# Altium project Engineering_project_DC_LOAD.PrjPcb
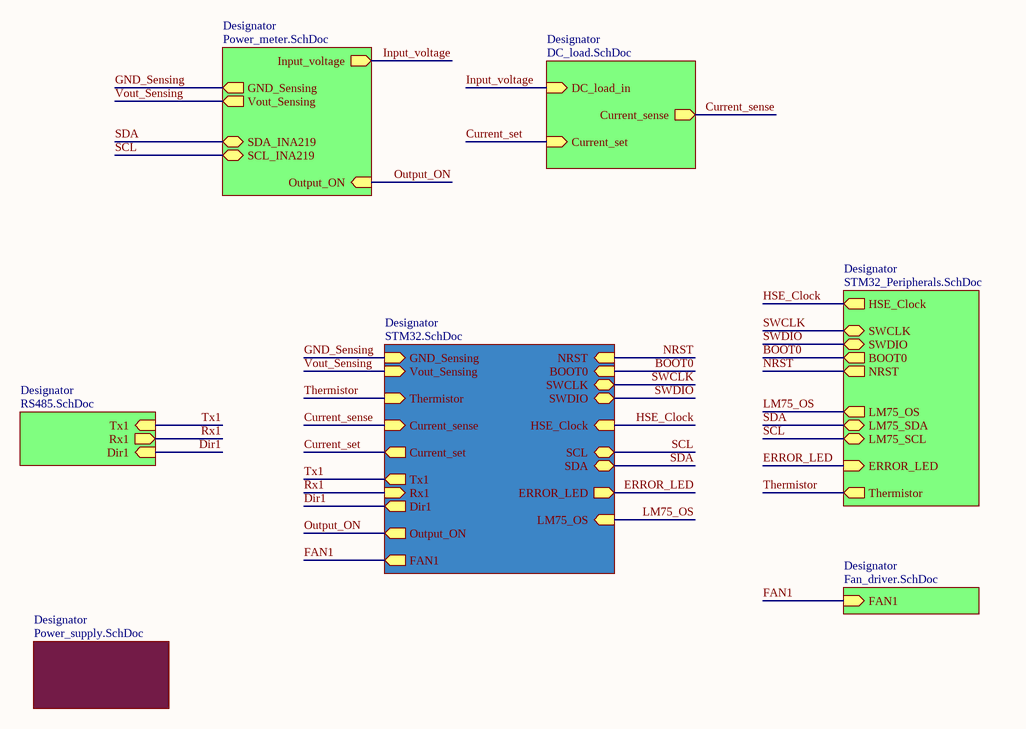
[diagram p0: Main.SchDoc]
8 sheets, 109 parts. Net scope: hierarchical (ports join the sheet entries above them; power ports are global).
Board file: PCB1.PcbDoc
Sheets:
  Main.SchDoc
    Designator = DC_load.SchDoc
    Designator = Power_meter.SchDoc
    Designator = RS485.SchDoc
    Designator = Fan_driver.SchDoc
    Designator = Power_supply.SchDoc
    Designator = STM32.SchDoc
    Designator = STM32_Peripherals.SchDoc

## Sheet Main.SchDoc
size A; SheetNumber: 1; SheetTotal: 8

### Sub-sheets
Designator = DC_load.SchDoc: Current_set (in), DC_load_in (in), Current_sense (out)
Designator = Power_meter.SchDoc: SCL_INA219 (bidir), SDA_INA219 (bidir), Output_ON (in), GND_Sensing (out), Vout_Sensing (out), Input_voltage (out)
Designator = RS485.SchDoc: Tx1 (in), Rx1 (out), Dir1 (in)
Designator = Fan_driver.SchDoc: FAN1 (in)
Designator = Power_supply.SchDoc: no entries
Designator = STM32.SchDoc: NRST (in), BOOT0 (in), SWCLK (bidir), SWDIO (bidir), SCL (bidir), SDA (bidir), GND_Sensing (in), Vout_Sensing (in), FAN1 (out), LM75_OS (in), HSE_Clock (in), ERROR_LED (out), Tx1 (out), Rx1 (in), Dir1 (out), Output_ON (out), Current_set (out), Thermistor (in), Current_sense (in)
Designator = STM32_Peripherals.SchDoc: HSE_Clock (out), SWCLK (bidir), SWDIO (bidir), BOOT0 (out), NRST (out), LM75_OS (out), LM75_SDA (bidir), LM75_SCL (bidir), ERROR_LED (in), Thermistor (out)

### Nets
BOOT0: sheet Designator/BOOT0, sheet Designator/BOOT0
Current_sense: sheet Designator/Current_sense, sheet Designator/Current_sense
Current_set: sheet Designator/Current_set, sheet Designator/Current_set
Dir1: sheet Designator/Dir1, sheet Designator/Dir1
ERROR_LED: sheet Designator/ERROR_LED, sheet Designator/ERROR_LED
FAN1: sheet Designator/FAN1, sheet Designator/FAN1
GND_Sensing: sheet Designator/GND_Sensing, sheet Designator/GND_Sensing
HSE_Clock: sheet Designator/HSE_Clock, sheet Designator/HSE_Clock
Input_voltage: sheet Designator/DC_load_in, sheet Designator/Input_voltage
LM75_OS: sheet Designator/LM75_OS, sheet Designator/LM75_OS
NRST: sheet Designator/NRST, sheet Designator/NRST
Output_ON: sheet Designator/Output_ON, sheet Designator/Output_ON
Rx1: sheet Designator/Rx1, sheet Designator/Rx1
SCL: sheet Designator/SCL_INA219, sheet Designator/SCL, sheet Designator/LM75_SCL
SDA: sheet Designator/SDA_INA219, sheet Designator/SDA, sheet Designator/LM75_SDA
SWCLK: sheet Designator/SWCLK, sheet Designator/SWCLK
SWDIO: sheet Designator/SWDIO, sheet Designator/SWDIO
Thermistor: sheet Designator/Thermistor, sheet Designator/Thermistor
Tx1: sheet Designator/Tx1, sheet Designator/Tx1
Vout_Sensing: sheet Designator/Vout_Sensing, sheet Designator/Vout_Sensing

## Sheet DC_load.SchDoc
size A; SheetNumber: 8; SheetTotal: 8
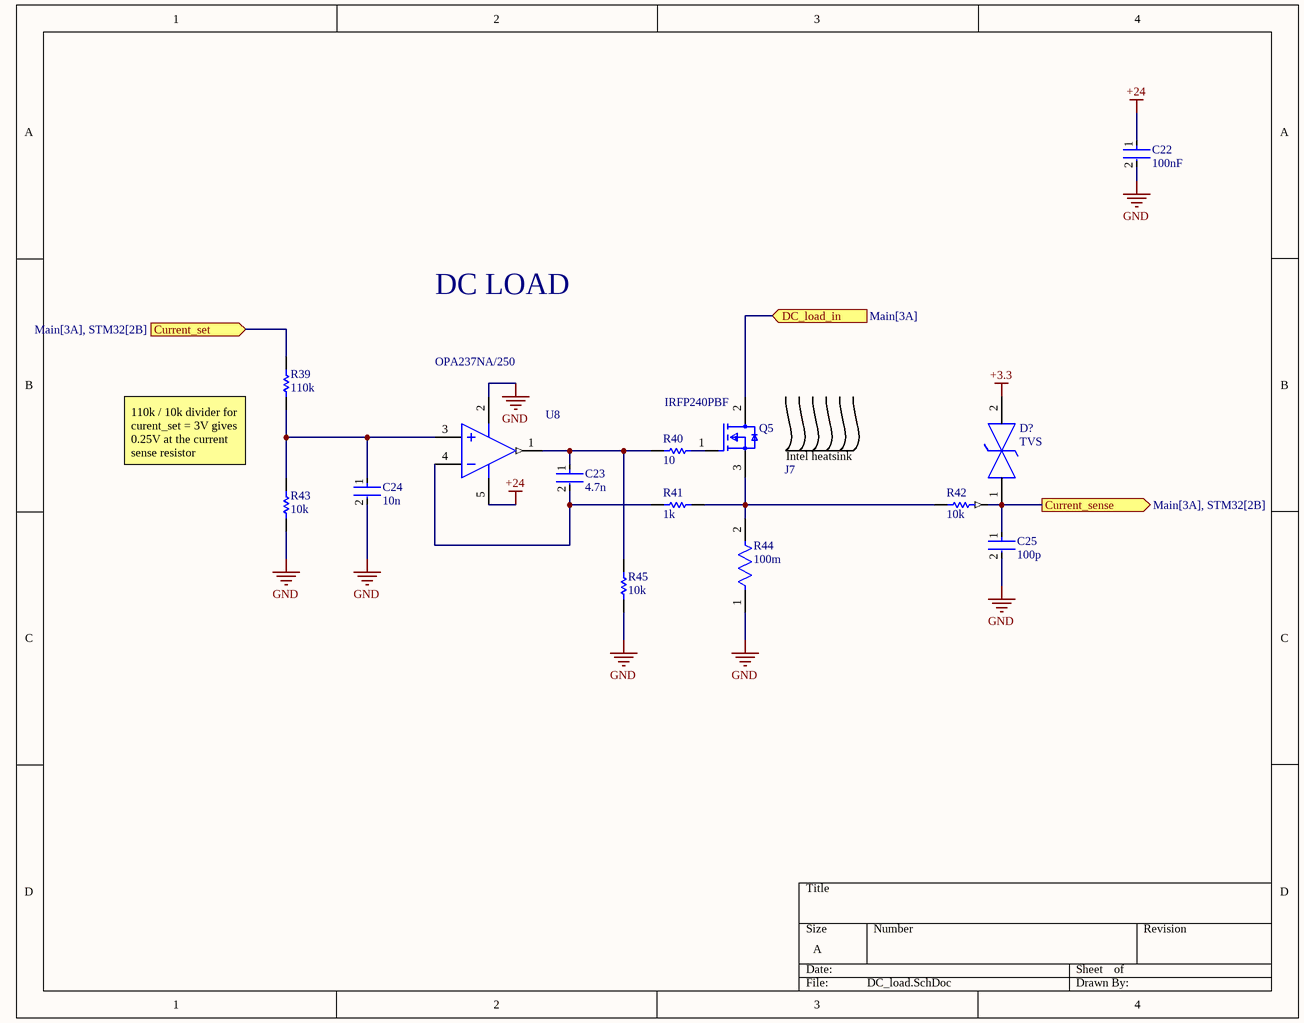
[diagram p1: DC_load.SchDoc]

### Parts
C22  100nF  [FP-0805-L_2_01_0_2-W_1_25-IPC_B]
C23  4.7n  [FP-0805-L_2_01_0_2-W_1_25-IPC_B]
C24  10n  [FP-0805-L_2_01_0_2-W_1_25-IPC_B]
C25  100p  [FP-0805-L_2_01_0_2-W_1_25-IPC_B]
D?  TVS  [FP-SMB-MFG]
J7  Intel heatsink  [Intel heatsink mount]  (value not drawn)
Q5  IRFP240PBF  [FP-E19-0614-MFG]
R39  110k  [RESC2013X50X30LL20T20]
R40  10  [RESC2013X50X30LL20T20]
R41  1k  [RESC2013X50X30LL20T20]
R42  10k  [RESC2013X50X30LL20T20]
R43  10k  [RESC2013X50X30LL20T20]
R44  100m  [FP-CRM2512-MFG]
R45  10k  [RESC2013X50X30LL20T20]
U8  OPA237NA/250  [DBV0005A_N]

### Ports
Current_sense (out, see Main[3A], STM32[2B]), Current_set (in, see Main[3A], STM32[2B]), DC_load_in (in, see Main[3A])

### Nets
+3.3: D?.2
+24: C22.1 U8.5(V+)
GND: C22.2 C24.2 C25.2 R43.1 R44.1 R45.1 U8.2(V-)
Current_sense: C25.1 D?.1 R42.1 ; port Current_sense
Current_set: R39.2 ; port Current_set
Input_voltage: Q5.2(D) ; port DC_load_in
NetC23_1: C23.1 R40.2 R45.2 U8.1(OUT)
NetC23_2: C23.2 R41.2 U8.4(IN-)
NetC24_1: C24.1 R39.1 R43.2 U8.3(IN+)
NetQ5_1: Q5.1(G) R40.1
NetQ5_3: Q5.3(S) R41.1 R42.2 R44.2

### Notes on the sheet
- DC LOAD
- 110k / 10k divider for curent_set = 3V gives 0.25V at the current sense resistor

### Library data of the parts
C22-C25 = CMP-2007-04174-2: General Purpose Ceramic Capacitor, 0805, 100nF, 10%, X7R, 15%, 100V; Packaging: Tape and Reel; Min Operating Temperature: -55°C; Dielectric Material: Ceramic; Height: 1.4mm; Voltage Rating: 100V; Termination: SMD/SMT; Case Code (Imperial): 0805; Case Code (Metric): 2012; Case/Package: 0805; Construction: Flat; Radiation Hardening: No; Series: -; Dielectric: X7R; Package Quantity: 2000; Mount: Surface Mount; Capacitance: 100nF; Contact Plating: Tin; Voltage: 100V; Lead Free: Lead Free; Depth: 1.25mm; RoHS Compliant: Yes; Number of Pins: 2; Max Operating Temperature: 125°C; Length: 2.01mm; Voltage Rating (DC): 100V; Thickness: 0.055inch; REACH SVHC: No SVHC; Width: 0.049inch; Tolerance: 10%
D? = CMP-12225-000039-1: TVS DIODE 28.2V 59V SMB; Manufacturer Part Number: SM6T33CA; Manufacturer: STMicroelectronics; Max Junction Temp: +150°C; Standoff Height: 0.05mm; Direction: Bidirectional; Number Of Channels: 1; Reverse Standoff Voltage: 33V; Peak Pulse Current: 68A; Breakdown Voltage: 31.4V; Peak Pulse Power: 600W; Mouser Description: TVS Diodes - Transient Voltage Suppressors 600W 33V Bidirect; Device Class L1: Circuit Protection; Device Class L3: unset; Temperature Range Low: -55°C; Octopart: https://octopart.com/sm6t33ca-stmicroelectronics-55399331; Height: 2.65mm; Digikey Description: TVS DIODE 28.2V 59V SMB; Automotive: No; Category: Diode; Device Class L2: TVS Diodes; Temperature: -55°C to +150°C; ComponentLink2URL: https://www.st.com/resource/en/datasheet/sm6t.pdf; Lead Free: Yes; Clamping Voltage: 59V; RoHS: TRUE; Temperature Range High: +150°C; Package: SMB; ComponentLink2Description: Datasheet
Q5 = CMP-02550-000013-1: MOSFET N-CH 200V 20A TO-247AC; Manufacturer: Vishay; Threshold Vgs: 4V; Input Capacitace At Vds: 1300pF @ 25V; Threshold Vgs Min: 2V; Reverse Recovery Time: 300ns; Pulse Drain Current: 80A; Depletion Mode: False; Power Dissipation: 150W; Number Of Channels: 1; Turn Off Delay Time: 45ns; Gate Charge At Vgs: 70nC @ 10V; Turn On Delay Time: 14ns; Reverse Recovery Charge: 3400nC; Rthja Max: 40°C/W; Gate To Source Voltage: 20V; Drain To Source Resistance: 0.18Ω; Max Junction Temp: +150°C; Standoff Height: 3.71mm; Category: Trans; Device Class L1: Discrete Semiconductors; Continuous Drain Current: 20A; Manufacturer Part Number: IRFP240PBF; Technology: MOSFET; Temperature Range Low: -55°C; Device Class L3: MOSFETs; Octopart: https://octopart.com/irfp240pbf-vishay-46527395; RoHS: TRUE; Threshold Vgs Max: 4V; Max Forward Diode Voltage: 2V; Lead Free: Yes; Mouser Description: MOSFET N-Chan 200V 20 Amp; Temperature Range High: +150°C; ComponentLink2Description: Datasheet; Number Of N Channels: 1; Height: 25.11mm; Ipc Land Pattern Name: TO-220; Temperature: -55°C to +150°C; Device Class L2: Transistors; ComponentLink2URL: http://www.vishay.com/docs/91210/91210.pdf; Package: E19-0614; Drain To Source Voltage: 200V; Digikey Description: MOSFET N-CH 200V 20A TO-247AC; Automotive: No; Drain To Source Breakdown Voltage: 200V
R39-R43 R45 = CMP-2001-04896-1: Manufacturer: Vishay Dale; Part Number: CRCW08050000Z0EA
R44 = CMP-07231-000004-1: RES 0.1 OHM 1% 2W 2512; Manufacturer: Bourns; 3DS Part Number: 110-00004; Manufacturer Part Number: CRM2512-FX-R100ELF; Resistance: 100mΩ; Voltage: 1.349V; Temperature Coefficient: 100ppm/°C; Value: 100mΩ; Voltage Rating: 1349mV; ComponentLink2Description: Datasheet; Lead Free: Yes; RoHS: TRUE; Ipc Land Pattern Name: RESC630310X60; Temperature: -55°C to +155°C; Package: CRM2512; Temperature Range High: +155°C; Mouser Description: Thick Film Resistors 2watts 1% .1ohms 100 PPM 2512; Category: Res; Temperature Range Low: -55°C; Series: CRM2512; Device Class L3: Chip SMD Resistors; Composition: Thick Film; Height: 0.8mm; Device Class L2: Resistors; Automotive: No; Device Class L1: Passive Components; Octopart: https://octopart.com/crm2512-fx-r100elf-bourns-9081968; Digikey Description: RES 0.1 OHM 1% 2W 2512; Power Rating: 2W; ComponentLink2URL: https://www.bourns.com/docs/product-datasheets/crm.pdf?sfvrsn=580c66f6_5; Tolerance: 1%
U8 = CMP-0272-00854-3: Single-Supply Operational Amplifier MicroAmplifier(TM) Series, 2.7 to 36 V, -55 to 125 degC, 5-pin SOT23 (DBV5), Green (RoHS & no Sb/Br); Manufacturer: Texas Instruments; Total Supply Voltage(Max)(+5V is 5, +/-5V is 10): 36; Packing: SMALL T&R; CMRR(Min)(dB): 78; Vio (25C)(Max)(mV): 0.75; Total Supply Voltage(Min)(+5V is 5, +/-5V is 10): 2.7; Rating: Catalog; Slew Rate(Typ)(V/us): 0.5; Number of Channels: 1; GBW(Typ)(MHz): 1.4; Sub Family: High Supply Voltage Amplifier (>=30V), Low Power Amp (<=500uA), Low Supply Voltage Amplifier (<=2.7V), Precision Amplifier; IIB(Max)(pA): 40000; Iq per channel(Max)(mA): 0.35; Offset Drift(Typ)(uV/C): 2; DatasheetVersion: SBOS057A; PackageVersion: 4073253-4/K, 03/2006; ComponentLink1URL: http://www.ti.com/; ComponentLink2Description: Datasheet; ComponentLink3Description: Package Specification; PackageReference: DBV0005A; Mounting Technology: Surface Mount; ComponentLink3URL: http://www.ti.com/litv/pdf/mpds018i; PartNumber: OPA237NA/250; Eco-Plan: Green (RoHS & no Sb/Br); ComponentLink1Description: Manufacturer URL; PackageDescription: 5-Pin Plastic Small Outline, Body 1.6 x 2.9 mm, Pitch 0.95 mm; ComponentLink2URL: http://www.ti.com/lit/ds/symlink/opa237.pdf; Code_JEDEC: MO-178

## Sheet Power_meter.SchDoc
size A; SheetNumber: 7; SheetTotal: 8
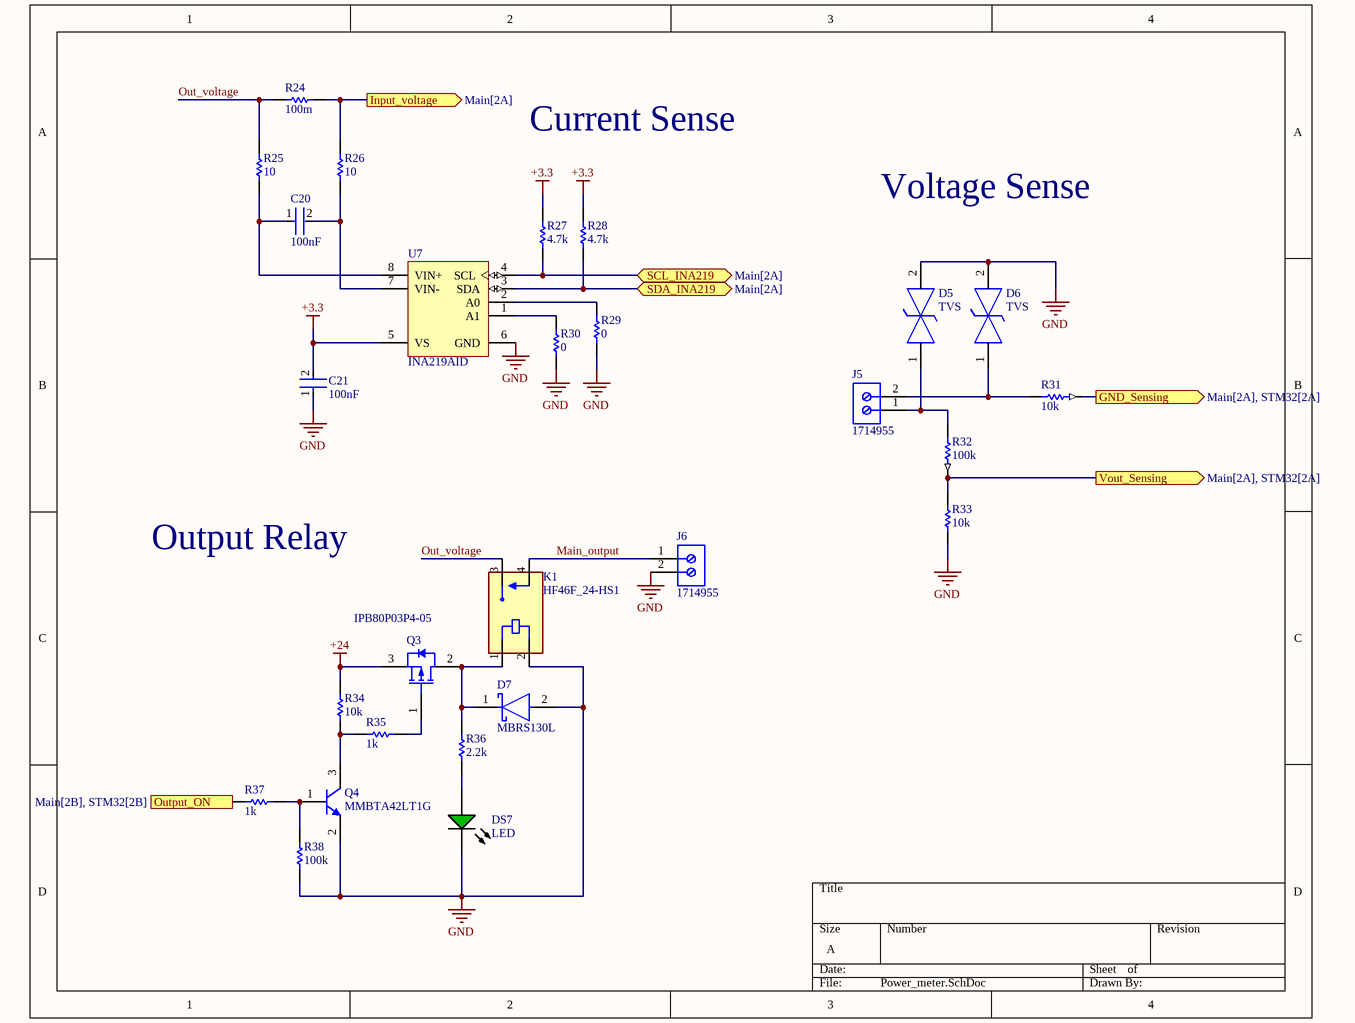
[diagram p2: Power_meter.SchDoc]

### Parts
C20  100nF  [FP-0805-L_2_01_0_2-W_1_25-IPC_B]
C21  100nF  [FP-0805-L_2_01_0_2-W_1_25-IPC_B]
D5  TVS  [FP-SMB-MFG]
D6  TVS  [FP-SMB-MFG]
D7  MBRS130L  [FP-403AF-MFG]
DS7  LED  [AVAG-HSMX-C170_V]
J5  1714955  [PHOE-1714955_V]
J6  1714955  [PHOE-1714955_V]
K1  HF46F_24-HS1  [RELAY_HF46F_005-HS1]
Q3  IPB80P03P4-05  [INF-PG-TO263-3-2_N]
Q4  MMBTA42LT1G  [ONSC-SOT-23-3-318-08_V]
R24  100m  [RESC3216X70X50NL05T20]
R25  10  [RESC2013X50X30LL20T20]
R26  10  [RESC2013X50X30LL20T20]
R27  4.7k  [RESC2013X50X30LL20T20]
R28  4.7k  [RESC2013X50X30LL20T20]
R29  0  [RESC2013X50X30LL20T20]
R30  0  [RESC2013X50X30LL20T20]
R31  10k  [RESC2013X50X30LL20T20]
R32  100k  [RESC2013X50X30LL20T20]
R33  10k  [RESC2013X50X30LL20T20]
R34  10k  [RESC2013X50X30LL20T20]
R35  1k  [RESC2013X50X30LL20T20]
R36  2.2k  [RESC2013X50X30LL20T20]
R37  1k  [RESC2013X50X30LL20T20]
R38  100k  [RESC2013X50X30LL20T20]
U7  INA219AID  [D0008A_N]

### Ports
GND_Sensing (out, see Main[2A], STM32[2A]), Input_voltage (out, see Main[2A]), Output_ON (in, see Main[2B], STM32[2B]), SCL_INA219 (bidir, see Main[2A]), SDA_INA219 (bidir, see Main[2A]), Vout_Sensing (out, see Main[2A], STM32[2A])

### Nets
+3.3: C21.2 R27.2 R28.2 U7.5(VS)
+24: Q3.3(SOURCE) R34.2
GND: C21.1 D5.2 D6.2 D7.2(A) DS7.2(K) J6.2 K1.2(COIL2) Q4.2(E) R29.1 R30.1 R33.2 R38.1 U7.6(GND)
GND_Sensing: R31.1 ; port GND_Sensing
Input_voltage: R24.2 R26.2 ; port Input_voltage
Main_output: J6.1 K1.4(NO)
Out_voltage: K1.3(COM) R24.1 R25.2
Output_ON: R37.1 ; port Output_ON
SCL: R27.1 U7.4(SCL) ; port SCL_INA219
SDA: R28.1 U7.3(SDA) ; port SDA_INA219
Vout_Sensing: R32.2 R33.1 ; port Vout_Sensing
NetC20_1: C20.1 R25.1 U7.8(VIN+)
NetC20_2: C20.2 R26.1 U7.7(VIN-)
NetD5_1: D5.1 J5.1 R32.1
NetD6_1: D6.1 J5.2 R31.2
NetD7_1: D7.1(C) K1.1(COIL1) Q3.2(DRAIN) R36.2
NetDS7_1: DS7.1(A) R36.1
NetQ3_1: Q3.1(GATE) R35.2
NetQ4_1: Q4.1(B) R37.2 R38.2
NetQ4_3: Q4.3(C) R34.1 R35.1
NetR29_2: R29.2 U7.2(A0)
NetR30_2: R30.2 U7.1(A1)

### Notes on the sheet
- Current Sense
- Voltage Sense
- Output Relay

### Library data of the parts
C20 C21 = CMP-2007-04174-2: as C22 on sheet DC_load; Packaging: Tape and Reel; Min Operating Temperature: -55°C; Dielectric Material: Ceramic; Height: 1.4mm; Voltage Rating: 100V; Termination: SMD/SMT; Case Code (Imperial): 0805; Case Code (Metric): 2012; Case/Package: 0805; Construction: Flat; Radiation Hardening: No; Series: -; Dielectric: X7R; Package Quantity: 2000; Mount: Surface Mount; Capacitance: 100nF; Contact Plating: Tin; Voltage: 100V; Lead Free: Lead Free; Depth: 1.25mm; RoHS Compliant: Yes; Number of Pins: 2; Max Operating Temperature: 125°C; Length: 2.01mm; Voltage Rating (DC): 100V; Thickness: 0.055inch; REACH SVHC: No SVHC; Width: 0.049inch; Tolerance: 10%
D5 D6 = CMP-12225-000039-1: as D? on sheet DC_load; Mouser Description: TVS Diodes - Transient Voltage Suppressors 600W 33V Bidirect; Device Class L1: Circuit Protection; Device Class L3: unset; Temperature Range Low: -55°C; Octopart: https://octopart.com/sm6t33ca-stmicroelectronics-55399331; Height: 2.65mm; Digikey Description: TVS DIODE 28.2V 59V SMB; Automotive: No; Category: Diode; Device Class L2: TVS Diodes; Temperature: -55°C to +150°C; ComponentLink2URL: https://www.st.com/resource/en/datasheet/sm6t.pdf; Lead Free: Yes; Clamping Voltage: 59V; RoHS: TRUE; Temperature Range High: +150°C; Package: SMB; ComponentLink2Description: Datasheet
D7 = CMP-00278-20916186-1: MBRS130L Rectifier Diode, Schottky, 1 Phase, 1 Element, 2A, 30V V(RRM), Silicon, DO-214AA; Manufacturer Lifecycle Status: OBSOLETE; Output Current: 1A; Forward Voltage: 445mV; Peak Reverse Current: 1mA; Max Surge Current: 40A; Polarity: Standard; Element Configuration: Single; Max Junction Temperature (Tj): 125°C; Lead Free: Lead Free; Packaging: Cut Tape; Mount: Surface Mount; Max Repetitive Reverse Voltage (Vrrm): 30V; Forward Current: 2A; Length: 4.75mm; Weight: 180mg; Radiation Hardening: No; Max Operating Temperature: 125°C; Schedule B: 8541100080; Peak Non-Repetitive Surge Current: 40A; Height: 2.45mm; Case/Package: SMB; Min Operating Temperature: -65°C; Average Rectified Current: 2A; Lifecycle Status: Obsolete; REACH SVHC: No SVHC; Voltage Rating (DC): 30V; Max Forward Surge Current (Ifsm): 40A; NexarPartId: 20916186; Max Reverse Leakage Current: 1mA; Number of Pins: 2; Width: 3.95mm; RoHS: Compliant; Max Reverse Voltage (DC): 30V; Current Rating: 1A
DS7 = CMP-2000-05062-1: Chip LED, Green, 2.2 V, -40 to 85 degC, 2-Pin SMD, Pb-Free, Tape and Reel; Manufacturer: Avago; No. of Pins: 2; Peak Wavelength: 570nm; SVHC: NoSVHC(16-Jun-2014); Dominant Wavelength: 572nm; Forward Current If: 20mA; Viewing Angle: 170deg; Lens Shape: Rectangular; PIV Max: 5V; External Width: 1.25mm; LED Type: Standard; External Depth: 0.8mm; Opto Mounting Orientation: Top; Luminous Intensity: 15mcd; Luminous Intensity Min: 4mcd; Forward Voltage VF Max: 2.6V; External Length / Height: 2mm; Bulb Size: 1.25mmx1.4mm; Light Area Height: 1mm; Voltage Vf Typ: 2.2V; Operating Temperature Max: 85degC; Datasheet Version: Oct-08; MSL: MSL2A-4weeks; Peak Forward Current: 20mA; Package Description: 2-Pin Surface Mount Device, Body 2 x 1.25 mm, Height 0.8 mm; Datasheet URL: https://datasheet.ciiva.com/29280/180495-da-01-en-chip-led-hsmg-c170-gelb-gruen-29280971.pdf; Storage Temperature Min: -40degC; LED Colour: Green; Wavelength Typ: 570nm; Mounting Type: SMD; Forward Current If Max: 20mA; Dominant Wavelength Typ: 572nm; LED Mounting: SMD; Operating Temperature Range: -30degCto+85degC; Operating Temperature Min: -30degC; Manufacturer URL: http://www.avagotech.com/; Packaging: CutTape; Luminous Intensity Typ: 15mcd; Package Reference: HSMX-C170; Storage Temperature Max: 85degC; Opto Case Style: SMD; Forward Voltage: 2.2V
J5 J6 = CMP-2000-05797-1: PC Terminal Block, Pitch 6.35 mm, 1 x 2 Position, Height 21.5 mm, Tail Lenght 5.1 mm, RoHS, Bulk; Manufacturer: Phoenix Contact; Package Description: PC Terminal Block, Pitch 6.35 mm, 1 x 2 Position, Height 21.5 mm, Tail Lenght 5.1 mm; Datasheet URL: http://media.digikey.com/pdf/Data%20Sheets/Phoenix%20Contact%20PDFs/1714955.pdf; Package Reference: 1714955; Manufacturer URL: http://www.phoenixcontact.com/; Datasheet Version: 02/2010; Mounting Technology: ThroughHole
K1 = HF46F_005-HS1: Relay: electromagnetic; SPST-NO; Ucoil: 24VDC; 5A/250VAC; 5A/30VDC; MF: Hongfa; MP: HF46F/005-HS1; SnapEDA_Link: https://www.snapeda.com/parts/HF46F/005-HS1/Hongfa/view-part/?ref=snap; Package: None; Value: *; Check_prices: https://www.snapeda.com/parts/HF46F/005-HS1/Hongfa/view-part/?ref=eda
Q3 = CMP-1138-00228-1: OptiMOS-P2 Power-Transistor, -30 V VDS, -80 A ID, PG-TO263-3-2, Reel, Green; Manufacturer: Infineon; Green: TRUE; RthJC (max): 1.1 K/W; RDS (on) (max) (@10V): 4.7 mOhm; VGS(th) (max): -4 V; QG: 100 nC; ID (max): -80 A; IDpuls (max): -320 A; VDS (max): -30 V; Ptot (max): 137 W; VGS(th) (min): -2 V; DatasheetVersion: Rev. 1.0; PackageReference: PG-TO263-3-2; ComponentLink1Description: Manufacturer URL; Mounting Technology: Surface Mount; PackageDescription: 3-Pin Plastic (Green) Transistor Single Outline Package, 10 x 9.25 mm Body, 2.54 mm Pitch; ComponentLink2URL: http://www.infineon.com/dgdl/IPP_B_I80P03P4-05_DS_10.pdf?folderId=db3a304314dca3890114ef902baa05f9&fileId=db3a30431ddc9372011e07ef59f52807&location=en.Products.Automotive_ICs.Automotive_MOSFETs.Single__P-Channel_30V_MOSFETs.DATASHEET.IPP_B_I80P03P4-05_DS_1; ComponentLink3Description: Package Specification; ComponentLink2Description: Datasheet; ComponentLink3URL: http://www.infineon.com/dgdl/BTS141TC_DS_10.pdf?folderId=db3a3043163797a6011667aa084c0e01&fileId=db3a3043242ebc9e01242f43f58b003e&location=en.Products.Automotive_ICs.Smart_High-_and_Low-Side_Switches.HITFET___TEMPFET__-_Smart_Low-Side_Switches.DATASHEET.BT; Halogen-free: TRUE; Technology: OptiMOS-P2; Packing: Reel; PartNumber: IPB80P03P4-05; ComponentLink1URL: http://www.infineon.com/; PackageVersion: Jul-09
Q4 = CMP-1048-00662-1: High Voltage Transistor, NPN Silicon, 3-Pin SOT-23, Pb-Free, Tape and Reel; Manufacturer: On Semiconductor; fT Min (MHz): 50; IC Continuous (A): 0.5; ComponentLink1URL: http://www.onsemi.com/; ComponentLink3URL: http://www.onsemi.cn/pub_link/Collateral/318-08.PDF; RoHS: TRUE; ComponentLink2Description: Datasheet; PartNumber: MMBTA42LT1G; Polarity: NPN; DatasheetVersion: Rev. 12; PackageReference: SOT-23-3-318-08; PackageDescription: 3-Pin Small Outline Transistor, Body 2.92 x 1.3 mm, Pitch 0.95 mm; ComponentLink3Description: Package Specification; ComponentLink1Description: Manufacturer URL; Packing: Tape and Reel; PackageVersion: Rev. AP, 11/2009; Mounting Technology: Surface Mount; ComponentLink2URL: http://www.onsemi.cn/pub_link/Collateral/MMBTA42LT1-D.PDF
R24 = CMP-2003-00761-1: Shunt resistor; Part Number: ERJ8BSFR10V; Manufacturer: Panasonic
R25-R38 = CMP-2001-04896-1: as R39 on sheet DC_load
U7 = CMP-0704-00006-2: Zero-Drift, Bi-Directional Current / Power Monitor, 3 to 5.5 V, -40 to 125 degC, 8-pin SOIC (D8), Green (RoHS & no Sb/Br); Manufacturer: Texas Instruments; Vs(Max)(V): 5.5; Rating: Catalog; Gain(V/V): 1, 0.5, 0.25, 0.125; Vs(Min)(V): 3; Common Mode Range(Max)(V): 26; Input Offset (+/-)(Max)(uV): 100; Small-Signal Bandwidth(Typ)(MHz): 0.011; SubFamily: Current Shunt Monitor; Common Mode Range(Min)(V): 0; Quiescent Current (+/-)(Typ)(mA): 0.7; PartNumber: INA219AID; ComponentLink2Description: Datasheet; PackageVersion: 4040047-3/M, 06/2011; ComponentLink3Description: Package Specification; Mounting Technology: Surface Mount; ComponentLink2URL: http://www.ti.com/general/docs/lit/getliterature.tsp?genericPartNumber=INA219&fileType=pdf; Eco-Plan: Green (RoHS & no Sb/Br); DatasheetVersion: SBOS448F; Code_JEDEC: MS-012; PackageDescription: 8-Pin Plastic Small Outline, Body 4.9 x 3.9 mm, Pitch 1.27 mm; ComponentLink1Description: Manufacturer URL; ComponentLink1URL: http://www.ti.com/; PackageReference: D0008A; ComponentLink3URL: http://www.ti.com/lit/ml/msoi002j/msoi002j.pdf; CMRR(Min)(dB): 100

## Sheet RS485.SchDoc
size A; SheetNumber: 2; SheetTotal: 8
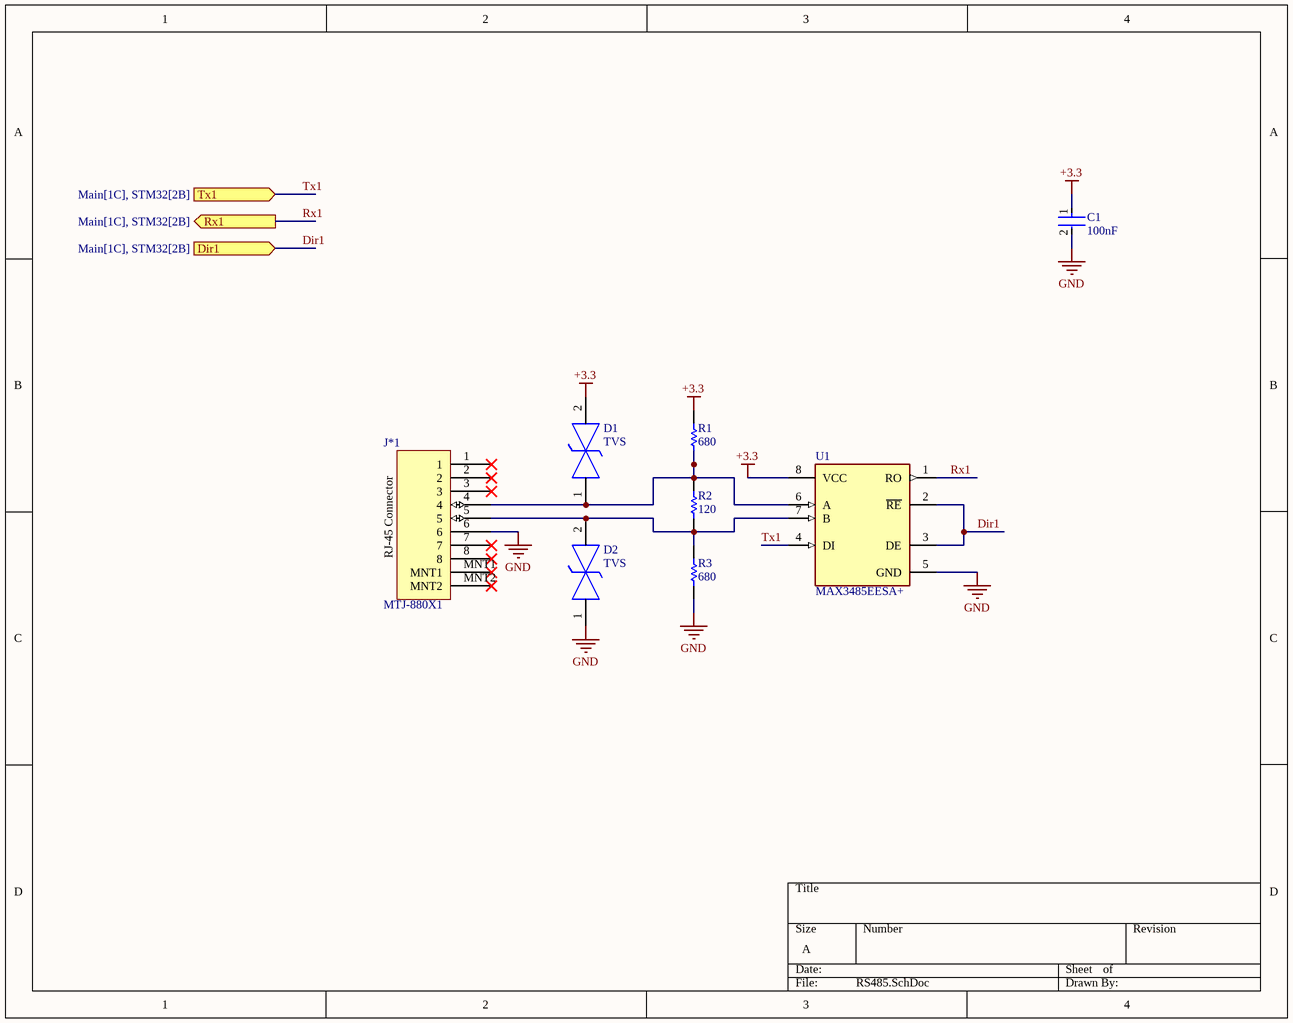
[diagram p3: RS485.SchDoc]

### Parts
C1  100nF  [FP-0805-L_2_01_0_2-W_1_25-IPC_B]
D1  TVS  [FP-SMB-MFG]
D2  TVS  [FP-SMB-MFG]
J*1  MTJ-880X1  [MTJ-880X1]
R1  680  [RESC2013X50X30LL20T20]
R2  120  [RESC2013X50X30LL20T20]
R3  680  [RESC2013X50X30LL20T20]
U1  MAX3485EESA+  [FP-S8-5-MFG]

### Ports
Dir1 (in, see Main[1C], STM32[2B]), Rx1 (out, see Main[1C], STM32[2B]), Tx1 (in, see Main[1C], STM32[2B])

### Nets
+3.3: C1.1 D1.2 R1.2 U1.8(VCC)
GND: C1.2 D2.1 J*1.6 R3.1 U1.5(GND)
Dir1: U1.2(~{RE}) U1.3(DE) ; port Dir1
Rx1: U1.1(RO) ; port Rx1
Tx1: U1.4(DI) ; port Tx1
NetD1_1: D1.1 J*1.4 R1.1 R2.2 U1.6(A)
NetD2_2: D2.2 J*1.5 R2.1 R3.2 U1.7(B)

Not connected (* = marked no-connect by the designer): J*1 1* 2* 3* 7* 8* MNT1* MNT2*

### Notes on the sheet
- (in symbol MTJ-880X1) RJ-45 Connector

### Library data of the parts
C1 = CMP-2007-04174-2: as C22 on sheet DC_load; Packaging: Tape and Reel; Min Operating Temperature: -55°C; Dielectric Material: Ceramic; Height: 1.4mm; Voltage Rating: 100V; Termination: SMD/SMT; Case Code (Imperial): 0805; Case Code (Metric): 2012; Case/Package: 0805; Construction: Flat; Radiation Hardening: No; Series: -; Dielectric: X7R; Package Quantity: 2000; Mount: Surface Mount; Capacitance: 100nF; Contact Plating: Tin; Voltage: 100V; Lead Free: Lead Free; Depth: 1.25mm; RoHS Compliant: Yes; Number of Pins: 2; Max Operating Temperature: 125°C; Length: 2.01mm; Voltage Rating (DC): 100V; Thickness: 0.055inch; REACH SVHC: No SVHC; Width: 0.049inch; Tolerance: 10%
D1 D2 = CMP-12225-000039-1: as D? on sheet DC_load; Mouser Description: TVS Diodes - Transient Voltage Suppressors 600W 33V Bidirect; Device Class L1: Circuit Protection; Device Class L3: unset; Temperature Range Low: -55°C; Octopart: https://octopart.com/sm6t33ca-stmicroelectronics-55399331; Height: 2.65mm; Digikey Description: TVS DIODE 28.2V 59V SMB; Automotive: No; Category: Diode; Device Class L2: TVS Diodes; Temperature: -55°C to +150°C; ComponentLink2URL: https://www.st.com/resource/en/datasheet/sm6t.pdf; Lead Free: Yes; Clamping Voltage: 59V; RoHS: TRUE; Temperature Range High: +150°C; Package: SMB; ComponentLink2Description: Datasheet
R1-R3 = CMP-2001-04896-1: as R39 on sheet DC_load
U1 = CMP-05679-000038-1: IC TXRX RS485/422 10MBPS 8SOIC; Manufacturer: Maxim Integrated; Number Of Receivers: 1; Simplex Duplex: Half Duplex; Data Rate: 15Mbits/s; Interface: RS-485,RS-422; Max Supply Voltage: 3.6V; Nominal Supply Current: 0.95-1.1mA; Min Supply Voltage: 3V; Standoff Height: 0.1mm; Mouser Description: RS-422/RS-485 Interface IC 3.3V 12Mbps Transceiver; Lead Free: Yes; Footprint Url: https://pdfserv.maximintegrated.com/land_patterns/90-0096.PDF; Device Class L1: Integrated Circuits (ICs); Device Class L3: RS-232 / RS-422 / RS-485 Interface ICs; RoHS: TRUE; Height: 1.75mm; ComponentLink2URL: https://datasheets.maximintegrated.com/en/ds/MAX3483E-MAX3491E.pdf; Temperature Range High: +85°C; Temperature: -40°C to +85°C; Manufacturer Part Number: MAX3485EESA+; Number Of Transmitters: 1; Device Class L2: Interface ICs; Octopart: https://octopart.com/max3485eesa%2B-maxim+integrated-39731903; ComponentLink2Description: Datasheet; Category: IC; Digikey Description: IC TXRX RS485/422 10MBPS 8SOIC; Automotive: No; Temperature Range Low: -40°C; Package: S8-5

## Sheet Fan_driver.SchDoc
size A; SheetNumber: 4; SheetTotal: 8
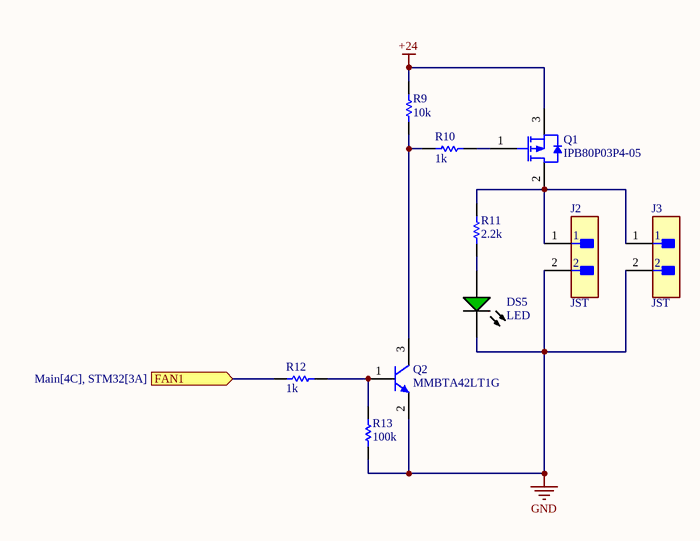
[diagram p4: Fan_driver.SchDoc]

### Parts
DS5  LED  [AVAG-HSMX-C170_V]
J2  JST  [FP-B2B-EH-A_LF_SN-MFG]
J3  JST  [FP-B2B-EH-A_LF_SN-MFG]
Q1  IPB80P03P4-05  [INF-PG-TO263-3-2_N]
Q2  MMBTA42LT1G  [ONSC-SOT-23-3-318-08_V]
R9  10k  [RESC2013X50X30LL20T20]
R10  1k  [RESC2013X50X30LL20T20]
R11  2.2k  [RESC2013X50X30LL20T20]
R12  1k  [RESC2013X50X30LL20T20]
R13  100k  [RESC2013X50X30LL20T20]

### Ports
FAN1 (in, see Main[4C], STM32[3A])

### Nets
+24: Q1.3(SOURCE) R9.2
GND: DS5.2(K) J2.2 J3.2 Q2.2(E) R13.1
FAN1: R12.1 ; port FAN1
NetDS5_1: DS5.1(A) R11.1
NetJ2_1: J2.1 J3.1 Q1.2(DRAIN) R11.2
NetQ1_1: Q1.1(GATE) R10.2
NetQ2_1: Q2.1(B) R12.2 R13.2
NetQ2_3: Q2.3(C) R9.1 R10.1

### Library data of the parts
DS5 = CMP-2000-05062-1: as DS7 on sheet Power_meter; Operating Temperature Max: 85degC; Datasheet Version: Oct-08; MSL: MSL2A-4weeks; Peak Forward Current: 20mA; Package Description: 2-Pin Surface Mount Device, Body 2 x 1.25 mm, Height 0.8 mm; Datasheet URL: https://datasheet.ciiva.com/29280/180495-da-01-en-chip-led-hsmg-c170-gelb-gruen-29280971.pdf; Storage Temperature Min: -40degC; LED Colour: Green; Wavelength Typ: 570nm; Mounting Type: SMD; Forward Current If Max: 20mA; Dominant Wavelength Typ: 572nm; LED Mounting: SMD; Operating Temperature Range: -30degCto+85degC; Operating Temperature Min: -30degC; Manufacturer URL: http://www.avagotech.com/; Packaging: CutTape; Luminous Intensity Typ: 15mcd; Package Reference: HSMX-C170; Storage Temperature Max: 85degC; Opto Case Style: SMD; Forward Voltage: 2.2V
J2 J3 = CMP-17439-000026-1: CONN HEADER VERT 2POS 2.5MM; Number of Contacts: 2; Current Rating: 3A; Connector Type: Plug; Contact Resistance: 20mR; Gender: Male; Voltage Rating: 250V; Fastening Type: Detent; Depth: 3.8mm; Max Operating Temperature: 85°C; Orientation: Straight; Series: EH; Contact Plating: Tin; Min Operating Temperature: -25°C; Contact Type: Male Pin; Housing Color: White; Termination: Press-Fit; Housing Material: Nylon; Pitch: 2.5mm; Number of Positions: 2; Max Current Rating: 3A; Packaging: Bulk; Lead Free: Lead Free; Number of Rows: 1; Length: 7.5mm; Contact Mating Length: 0.13inch; Color: Natural; Max Voltage Rating (AC): 250V; Contact Material: Copper Alloy; Mount: Through Hole
Q1 = CMP-1138-00228-1: as Q3 on sheet Power_meter; DatasheetVersion: Rev. 1.0; PackageReference: PG-TO263-3-2; ComponentLink1Description: Manufacturer URL; Mounting Technology: Surface Mount; PackageDescription: 3-Pin Plastic (Green) Transistor Single Outline Package, 10 x 9.25 mm Body, 2.54 mm Pitch; ComponentLink2URL: http://www.infineon.com/dgdl/IPP_B_I80P03P4-05_DS_10.pdf?folderId=db3a304314dca3890114ef902baa05f9&fileId=db3a30431ddc9372011e07ef59f52807&location=en.Products.Automotive_ICs.Automotive_MOSFETs.Single__P-Channel_30V_MOSFETs.DATASHEET.IPP_B_I80P03P4-05_DS_1; ComponentLink3Description: Package Specification; ComponentLink2Description: Datasheet; ComponentLink3URL: http://www.infineon.com/dgdl/BTS141TC_DS_10.pdf?folderId=db3a3043163797a6011667aa084c0e01&fileId=db3a3043242ebc9e01242f43f58b003e&location=en.Products.Automotive_ICs.Smart_High-_and_Low-Side_Switches.HITFET___TEMPFET__-_Smart_Low-Side_Switches.DATASHEET.BT; Halogen-free: TRUE; Technology: OptiMOS-P2; Packing: Reel; PartNumber: IPB80P03P4-05; ComponentLink1URL: http://www.infineon.com/; PackageVersion: Jul-09
Q2 = CMP-1048-00662-1: as Q4 on sheet Power_meter; ComponentLink1URL: http://www.onsemi.com/; ComponentLink3URL: http://www.onsemi.cn/pub_link/Collateral/318-08.PDF; RoHS: TRUE; ComponentLink2Description: Datasheet; PartNumber: MMBTA42LT1G; Polarity: NPN; DatasheetVersion: Rev. 12; PackageReference: SOT-23-3-318-08; PackageDescription: 3-Pin Small Outline Transistor, Body 2.92 x 1.3 mm, Pitch 0.95 mm; ComponentLink3Description: Package Specification; ComponentLink1Description: Manufacturer URL; Packing: Tape and Reel; PackageVersion: Rev. AP, 11/2009; Mounting Technology: Surface Mount; ComponentLink2URL: http://www.onsemi.cn/pub_link/Collateral/MMBTA42LT1-D.PDF
R9-R13 = CMP-2001-04896-1: as R39 on sheet DC_load

## Sheet Power_supply.SchDoc
size A; SheetNumber: 3; SheetTotal: 8
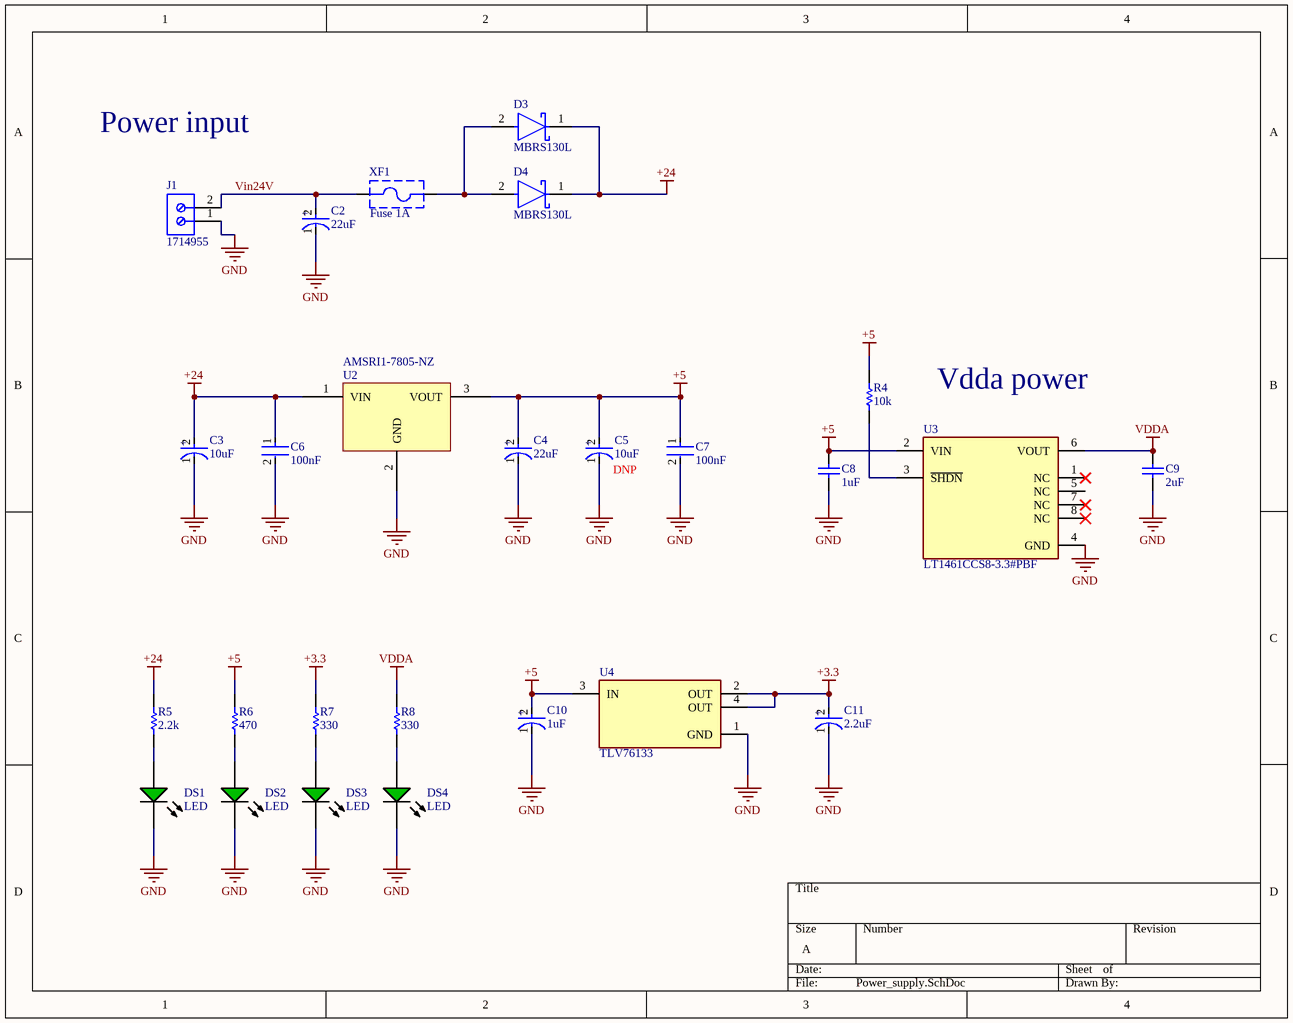
[diagram p5: Power_supply.SchDoc]

### Parts
C2  22uF  [FP-FCE-MFG]
C3  10uF  [FP-FKD-MFG]
C4  22uF  [FP-FCE-MFG]
C5  10uF  [FP-FKD-MFG]
C6  100nF  [FP-0805-L_2_01_0_2-W_1_25-IPC_B]
C7  100nF  [FP-0805-L_2_01_0_2-W_1_25-IPC_B]
C8  1uF  [CAPC2013X140X50LL20T25]
C9  2uF  [CAPC2013X140X50LL20T25]
C10  1uF  [FP-FKD-MFG]
C11  2.2uF  [FP-FKD-MFG]
D3  MBRS130L  [FP-403AF-MFG]
D4  MBRS130L  [FP-403AF-MFG]
DS1  LED  [AVAG-HSMX-C170_V]
DS2  LED  [AVAG-HSMX-C170_V]
DS3  LED  [AVAG-HSMX-C170_V]
DS4  LED  [AVAG-HSMX-C170_V]
J1  1714955  [PHOE-1714955_V]
R4  10k  [RESC2013X50X30LL20T20]
R5  2.2k  [RESC2013X50X30LL20T20]
R6  470  [RESC2013X50X30LL20T20]
R7  330  [RESC2013X50X30LL20T20]
R8  330  [RESC2013X50X30LL20T20]
U2  AMSRI1-7805-NZ  [SIP750W46P254L1400H1010Q3]
U3  LT1461CCS8-3.3#PBF  [FP-S8-8-05-08-1610-IPC_A]
U4  TLV76133  [FP-DCY0004A-MFG]
XF1  Fuse 1A  [696106003002]

### Nets
+3.3: C11.2(A) R7.2 U4.2(OUT) U4.4(OUT)
+5: C4.2(A) C5.2(A) C7.1 C8.2 C10.2(A) R4.2 R6.2 U2.3(VOUT) U3.2(VIN) U4.3(IN)
+24: C3.2(A) C6.1 D3.1(C) D4.1(C) R5.2 U2.1(VIN)
GND: C2.1(C) C3.1(C) C4.1(C) C5.1(C) C6.2 C7.2 C8.1 C9.1 C10.1(C) C11.1(C) DS1.2(K) DS2.2(K) DS3.2(K) DS4.2(K) J1.1 U2.2(GND) U3.4(GND) U4.1(GND)
VDDA: C9.2 R8.2 U3.6(VOUT)
Vin24V: C2.2(A) J1.2 XF1.1
NetD3_2: D3.2(A) D4.2(A) XF1.2
NetDS1_1: DS1.1(A) R5.1
NetDS2_1: DS2.1(A) R6.1
NetDS3_1: DS3.1(A) R7.1
NetDS4_1: DS4.1(A) R8.1
NetR4_1: R4.1 U3.3(~{SHDN})

Not connected (* = marked no-connect by the designer): U3 1(NC)* 5(NC) 7(NC)* 8(NC)*

### Notes on the sheet
- Power input
- Vdda power
- (near C5) DNP
- (in symbol CMP-2000-06207-2) +
- (in symbol CMP-05427-002128-1) +

### Library data of the parts
C2 C4 = CMP-05427-002128-1: CAP ALUM 22UF 20% 50V SMD; Ripple Current: 120mA; Material: Aluminium; ESR (Equivalent Series Resistance): 700mR; Polarity: Polar; Lead Length: 3.4mm; Leakage Current: 3uA; Life (Hours): 1000Hour; Diameter: 8mm; RoHS Compliant: Yes; Voltage Rating: 50V; Reach SVHC Compliant: Yes; Series: FC; Capacitance: 22uF; Ripple Current (AC): 120mA; Mount: Surface Mount; Min Operating Temperature: -40°C; Max Operating Temperature: 105°C; Radiation Hardening: No; Contact Plating: Tin; Impedance: 700mR; Construction: Cylindrical; Height - Seated (Max): 0.244inch; Packaging: Tape and Reel; Dielectric Material: Aluminium; Voltage: 50V; Voltage Rating (DC): 50V; Height: 6.2mm; Package Quantity: 1000; Length: 6.5mm; Lead Pitch: 2.2mm; Width: 8.3mm; Termination: SMD/SMT; Case/Package: Radial; Tolerance: 20%; Number of Pins: 2; Lead Free: Lead Free
C3 C5 C10 C11 = CMP-2000-06207-2: CAP ALUM 10UF 20% 50V SMD; Impedance: 880mR; Ripple Current: 165mA; Polarity: Polar; Leakage Current: 3uA; Lead Diameter: 0.65mm; Life (Hours): 2000Hour; REACH SVHC: No SVHC; Series: FK; Max Operating Temperature: 105°C; Radiation Hardening: No; Size: 5.8mm; Ripple Current (AC): 165mA; Lead Free: Lead Free; Voltage: 50V; Contact Plating: Tin; Case/Package: Radial; RoHS Compliant: Yes; Voltage Rating: 50V; Height - Seated (Max): 0.24inch; Package Quantity: 1000; Termination: SMD/SMT; Number of Pins: 2; Mount: Surface Mount; Packaging: Tape and Reel; Length: 5.8mm; Width: 7.8mm; Min Operating Temperature: -55°C; Height: 5.8mm; ESR (Equivalent Series Resistance): 880mR; Capacitance: 10uF; Diameter: 6.3mm; Voltage Rating (DC): 50V; Construction: Cylindrical; Tolerance: 20%; Lead Pitch: 1.8mm
C6 C7 = CMP-2007-04174-2: General Purpose Ceramic Capacitor, 0805, 10nF, 10%, X7R, 15%, 100V; Packaging: Tape and Reel; Min Operating Temperature: -55°C; Dielectric Material: Ceramic; Height: 1.4mm; Voltage Rating: 100V; Termination: SMD/SMT; Case Code (Imperial): 0805; Case Code (Metric): 2012; Case/Package: 0805; Construction: Flat; Radiation Hardening: No; Series: -; Dielectric: X7R; Package Quantity: 2000; Mount: Surface Mount; Capacitance: 100nF; Contact Plating: Tin; Voltage: 100V; Lead Free: Lead Free; Depth: 1.25mm; RoHS Compliant: Yes; Number of Pins: 2; Max Operating Temperature: 125°C; Length: 2.01mm; Voltage Rating (DC): 100V; Thickness: 0.055inch; REACH SVHC: No SVHC; Width: 0.049inch; Tolerance: 10%
C8 C9 = CMP-2007-03234-1: Part Number: C0805C105K3RACTU; Manufacturer: Kemet
D3 D4 = CMP-00278-20916186-1: as D7 on sheet Power_meter; Lead Free: Lead Free; Packaging: Cut Tape; Mount: Surface Mount; Max Repetitive Reverse Voltage (Vrrm): 30V; Forward Current: 2A; Length: 4.75mm; Weight: 180mg; Radiation Hardening: No; Max Operating Temperature: 125°C; Schedule B: 8541100080; Peak Non-Repetitive Surge Current: 40A; Height: 2.45mm; Case/Package: SMB; Min Operating Temperature: -65°C; Average Rectified Current: 2A; Lifecycle Status: Obsolete; REACH SVHC: No SVHC; Voltage Rating (DC): 30V; Max Forward Surge Current (Ifsm): 40A; NexarPartId: 20916186; Max Reverse Leakage Current: 1mA; Number of Pins: 2; Width: 3.95mm; RoHS: Compliant; Max Reverse Voltage (DC): 30V; Current Rating: 1A
DS1-DS4 = CMP-2000-05062-1: as DS7 on sheet Power_meter; Operating Temperature Max: 85degC; Datasheet Version: Oct-08; MSL: MSL2A-4weeks; Peak Forward Current: 20mA; Package Description: 2-Pin Surface Mount Device, Body 2 x 1.25 mm, Height 0.8 mm; Datasheet URL: https://datasheet.ciiva.com/29280/180495-da-01-en-chip-led-hsmg-c170-gelb-gruen-29280971.pdf; Storage Temperature Min: -40degC; LED Colour: Green; Wavelength Typ: 570nm; Mounting Type: SMD; Forward Current If Max: 20mA; Dominant Wavelength Typ: 572nm; LED Mounting: SMD; Operating Temperature Range: -30degCto+85degC; Operating Temperature Min: -30degC; Manufacturer URL: http://www.avagotech.com/; Packaging: CutTape; Luminous Intensity Typ: 15mcd; Package Reference: HSMX-C170; Storage Temperature Max: 85degC; Opto Case Style: SMD; Forward Voltage: 2.2V
J1 = CMP-2000-05797-1: as J5 on sheet Power_meter; Package Description: PC Terminal Block, Pitch 6.35 mm, 1 x 2 Position, Height 21.5 mm, Tail Lenght 5.1 mm; Datasheet URL: http://media.digikey.com/pdf/Data%20Sheets/Phoenix%20Contact%20PDFs/1714955.pdf; Package Reference: 1714955; Manufacturer URL: http://www.phoenixcontact.com/; Datasheet Version: 02/2010; Mounting Technology: ThroughHole
R4-R8 = CMP-2001-04896-1: as R39 on sheet DC_load
U2 = AMSRI1-7805-NZ: AMSRI1-7805-NZ, 5V / 1A DC output converter
U3 = CMP-09137-000077-1: IC VREF SERIES 0.08% 8SOIC; Output Type: Fixed; Max Output Current: 100mA; Reference Voltage: 3.3V; Quiescent Current: 50uA; Operating Supply Current: 70uA; Temperature Coefficient: 12ppm/°C; Max Input Voltage: 20V; Output Current: 100mA; Max Operating Temperature: 70°C; Width: 3.988mm; Series: -; REACH SVHC: No SVHC; RoHS Compliant: Yes; Length: 5mm; Case/Package: SOIC; Output Voltage: 3.3V; Mount: Surface Mount; Reference Type: Series; Package Quantity: 100; Min Output Voltage: 3.3V; Height: 1.498mm; Max Output Voltage: 3.3V; Min Operating Temperature: 0°C; Number of Pins: 8; Lead Free: Lead Free; Tolerance: 0.08%; Packaging: Rail/Tube
U4 = CMP-00370-134324849-1: TLV76133 1-A 16-V high-PSRR linear voltage regulator 4-SOT-223 -40 to 125; Manufacturer Lifecycle Status: ACTIVE; Number of Channels: 1; Min Supply Voltage: 6.5V; Nominal Supply Current: 65µA; Dropout Voltage: 900mV; Accuracy: 1%; Max Supply Voltage: 16V; Max Junction Temperature (Tj): 125°C; Output Current: 1A; Output Voltage: 5V; Width: 3.5mm; Length: 6.5mm; NexarPartId: 134324849; Max Operating Temperature: 125°C; Thickness: 1.6mm; Min Operating Temperature: -40°C; Case/Package: SOT-223; Height: 1.8mm; Lifecycle Status: Production; Number of Pins: 4; Number of Outputs: 1
XF1 = CMP-1502-00235-2: NexarPartId: 56808805; Fuse Current: 10A; Voltage Rating (AC): 250V; RoHS: Non-Compliant; Min Operating Temperature: -30°C; Height: 11.6mm; Packaging: Box; Mount: Through Hole; REACH SVHC: Unknown; Max Operating Temperature: 120°C

## Sheet STM32.SchDoc
size A; SheetNumber: 6; SheetTotal: 8
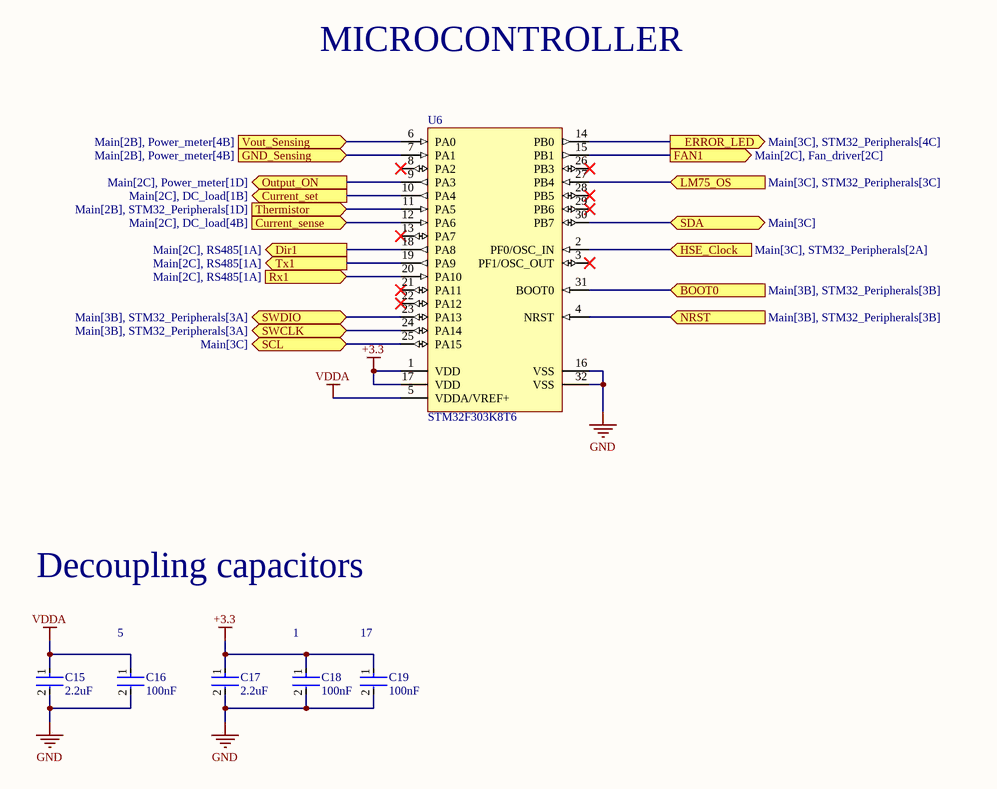
[diagram p6: STM32.SchDoc]

### Parts
C15  2.2uF  [FP-0805-L_2_01_0_2-W_1_25-IPC_B]
C16  100nF  [FP-CGA3E-0_3-0_1-IPC_A]
C17  2.2uF  [FP-0805-L_2_01_0_2-W_1_25-IPC_B]
C18  100nF  [FP-CGA3E-0_3-0_1-IPC_A]
C19  100nF  [FP-CGA3E-0_3-0_1-IPC_A]
U6  STM32F303K8T6  [STM-LQFP32_M]

### Ports
BOOT0 (in, see Main[3B], STM32_Peripherals[3B]), Current_sense (in, see Main[2C], DC_load[4B]), Current_set (out, see Main[2C], DC_load[1B]), Dir1 (out, see Main[2C], RS485[1A]), ERROR_LED (out, see Main[3C], STM32_Peripherals[4C]), FAN1 (out, see Main[2C], Fan_driver[2C]), GND_Sensing (in, see Main[2B], Power_meter[4B]), HSE_Clock (in, see Main[3C], STM32_Peripherals[2A]), LM75_OS (in, see Main[3C], STM32_Peripherals[3C]), NRST (in, see Main[3B], STM32_Peripherals[3B]), Output_ON (out, see Main[2C], Power_meter[1D]), Rx1 (in, see Main[2C], RS485[1A]), SCL (bidir, see Main[3C]), SDA (bidir, see Main[3C]), SWCLK (bidir, see Main[3B], STM32_Peripherals[3A]), SWDIO (bidir, see Main[3B], STM32_Peripherals[3A]), Thermistor (in, see Main[2B], STM32_Peripherals[1D]), Tx1 (out, see Main[2C], RS485[1A]), Vout_Sensing (in, see Main[2B], Power_meter[4B])

### Nets
+3.3: C17.1 C18.1 C19.1 U6.1(VDD) U6.17(VDD)
GND: C15.2 C16.2 C17.2 C18.2 C19.2 U6.16(VSS) U6.32(VSS)
VDDA: C15.1 C16.1 U6.5(VDDA/VREF+)
BOOT0: U6.31(BOOT0) ; port BOOT0
Current_sense: U6.12(PA6) ; port Current_sense
Current_set: U6.10(PA4) ; port Current_set
Dir1: U6.18(PA8) ; port Dir1
ERROR_LED: U6.14(PB0) ; port ERROR_LED
FAN1: U6.15(PB1) ; port FAN1
GND_Sensing: U6.7(PA1) ; port GND_Sensing
HSE_Clock: U6.2(PF0/OSC_IN) ; port HSE_Clock
LM75_OS: U6.27(PB4) ; port LM75_OS
NRST: U6.4(NRST) ; port NRST
Output_ON: U6.9(PA3) ; port Output_ON
Rx1: U6.20(PA10) ; port Rx1
SCL: U6.25(PA15) ; port SCL
SDA: U6.30(PB7) ; port SDA
SWCLK: U6.24(PA14) ; port SWCLK
SWDIO: U6.23(PA13) ; port SWDIO
Thermistor: U6.11(PA5) ; port Thermistor
Tx1: U6.19(PA9) ; port Tx1
Vout_Sensing: U6.6(PA0) ; port Vout_Sensing

Not connected (* = marked no-connect by the designer): U6 3(PF1/OSC_OUT)* 8(PA2)* 13(PA7)* 21(PA11)* 22(PA12)* 26(PB3)* 28(PB5)* 29(PB6)*

### Notes on the sheet
- MICROCONTROLLER
- Decoupling capacitors
- (near C16) 5
- (near C18) 1
- (near C19) 17

### Library data of the parts
C15 C17 = CMP-2007-04174-2: General Purpose Ceramic Capacitor, 0805, 10nF, 10%, X7R, 15%, 100V; Capacitance: 100nF; Packaging: Tape and Reel; Min Operating Temperature: -55°C; Dielectric Material: Ceramic; Height: 1.4mm; Voltage Rating: 100V; Termination: SMD/SMT; Case Code (Imperial): 0805; Case Code (Metric): 2012; Case/Package: 0805; Construction: Flat; Radiation Hardening: No; Series: -; Dielectric: X7R; Package Quantity: 2000; Mount: Surface Mount; Contact Plating: Tin; Voltage: 100V; Lead Free: Lead Free; Depth: 1.25mm; RoHS Compliant: Yes; Number of Pins: 2; Max Operating Temperature: 125°C; Length: 2.01mm; Voltage Rating (DC): 100V; Thickness: 0.055inch; REACH SVHC: No SVHC; Width: 0.049inch; Tolerance: 10%
C16 C18 C19 = CMP-2000-07546-2: Cap Ceramic 100nF 50V X7R 10% Pad SMD 0603 +125°C Automotive T/R; Weight: 7.1E-05oz; Composition: Ceramic; Max Operating Temperature: 125°C; Termination: SMD/SMT; Dielectric: X7R; Length: 1.6mm; Package Quantity: 1; REACH SVHC: No SVHC; Lead Free: Lead Free; Case Code (Metric): 1608; Min Operating Temperature: -55°C; Packaging: Tape and Reel; Tolerance: 10%; Voltage Rating: 50V; Case Code (Imperial): 0603; Capacitance: 100nF; Case/Package: 0603; Voltage Rating (DC): 50V; Depth: 0.8mm; Radiation Hardening: No; Ratings: AEC-Q200; Mount: Surface Mount; Voltage: 50V; Thickness: 0.035inch; Width: 0.8mm; Height: 0.8mm
U6 = CMP-0537-00040-1: ARM Cortex-M4 32-bit MCU, 64 KB Flash, 16 KB Internal RAM, 25 I/Os, 32-Pin LQFP, -40 to 85 degC, Tray; Supply Voltage(Vcc) min (V): 2; Internal RAM Size (kB): 16; D/A Converter: 3; FLASH Size (Prog) (kB): 64; I/Os (High Current): 25; Operating Frequency(F) (Processor speed) (MHz): 72; ComponentLink1URL: http://www.st.com/; Package Description: 32-Pin Low Profile Quad Flat Package, 7 x 7 mm Body, 0.8 mm Pitch; Mounting Technology: Surface Mount; ComponentLink2Description: Datasheet; ComponentLink2URL: http://www.st.com/st-web-ui/static/active/en/resource/technical/document/datasheet/DM00092070.pdf; Core: ARM Cortex-M4; ComponentLink1Description: Manufacturer URL; Package Reference: LQFP32; Packing: Tray; DatasheetVersion: Rev. 4

## Sheet STM32_Peripherals.SchDoc
size A; SheetNumber: 5; SheetTotal: 8
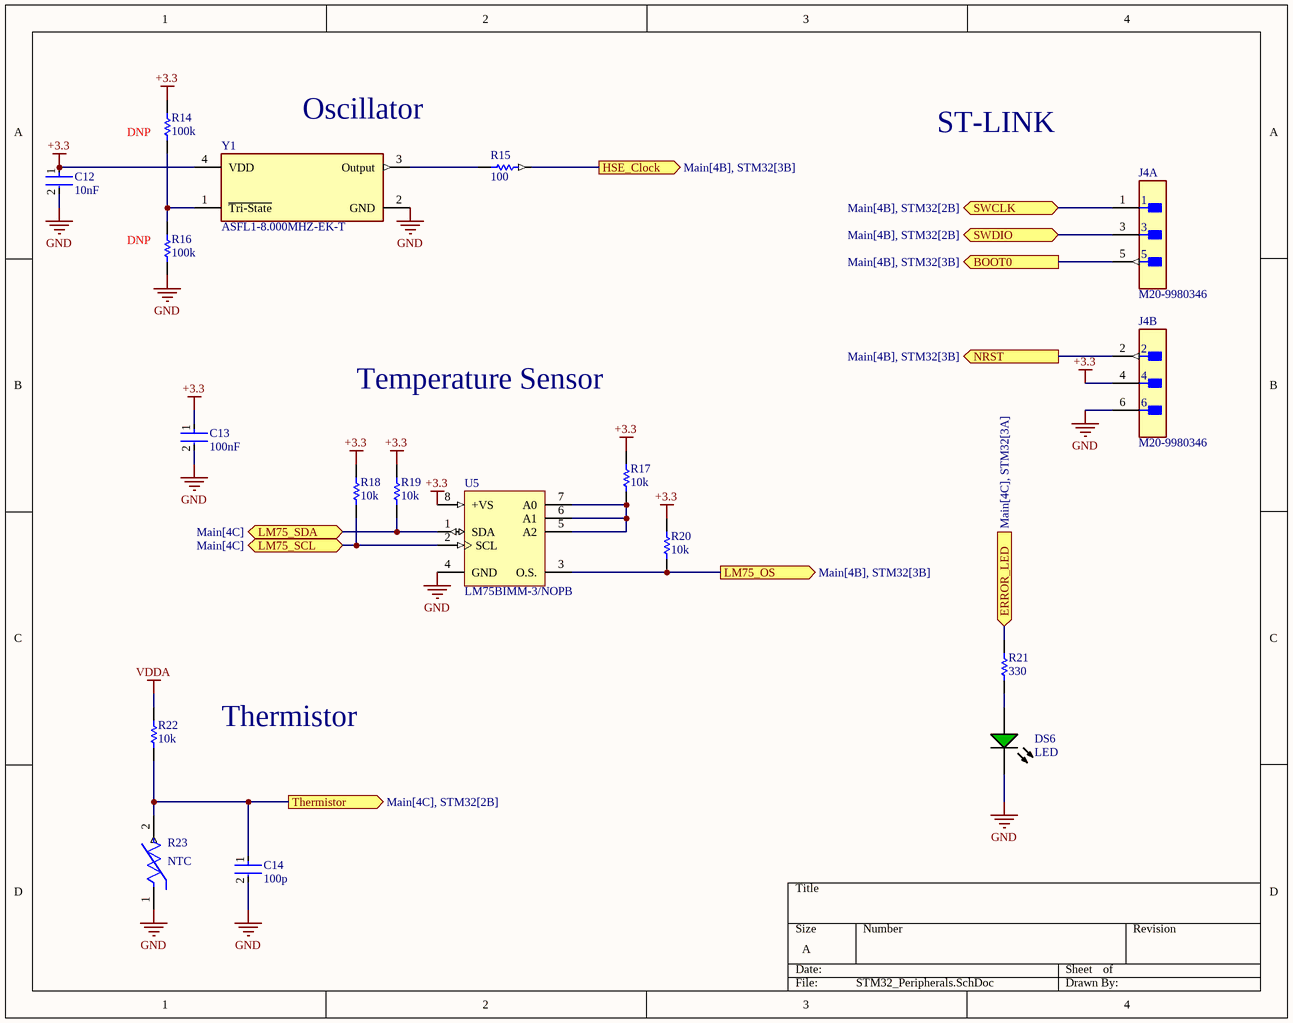
[diagram p7: STM32_Peripherals.SchDoc]

### Parts
C12  10nF  [FP-0805-L_2_01_0_2-W_1_25-IPC_B]
C13  100nF  [FP-0805-L_2_01_0_2-W_1_25-IPC_B]
C14  100p  [FP-0805-L_2_01_0_2-W_1_25-IPC_B]
DS6  LED  [AVAG-HSMX-C170_V]
J4  M20-9980346  [FP-M20-9980346-MFG]  (parts A,B of 2)
R14  100k  [RESC2013X50X30LL20T20]
R15  100  [RESC2013X50X30LL20T20]
R16  100k  [RESC2013X50X30LL20T20]
R17  10k  [RESC2013X50X30LL20T20]
R18  10k  [RESC2013X50X30LL20T20]
R19  10k  [RESC2013X50X30LL20T20]
R20  10k  [RESC2013X50X30LL20T20]
R21  330  [RESC2013X50X30LL20T20]
R22  10k  [RESC2013X50X30LL20T20]
R23  NTC  [FP-NTCALUG02A103G-MFG]
U5  LM75BIMM-3/NOPB  [DGK0008A_L]
Y1  ASFL1-8.000MHZ-EK-T  [FP-ASFL1-MFG]

### Ports
BOOT0 (out, see Main[4B], STM32[3B]), ERROR_LED (in, see Main[4C], STM32[3A]), HSE_Clock (out, see Main[4B], STM32[3B]), LM75_OS (out, see Main[4B], STM32[3B]), LM75_SCL (bidir, see Main[4C]), LM75_SDA (bidir, see Main[4C]), NRST (out, see Main[4B], STM32[3B]), SWCLK (bidir, see Main[4B], STM32[2B]), SWDIO (bidir, see Main[4B], STM32[2B]), Thermistor (out, see Main[4C], STM32[2B])

### Nets
+3.3: C12.1 C13.1 J4.4 R14.2 R17.2 R18.2 R19.2 R20.2 U5.8(+VS) Y1.4(VDD)
GND: C12.2 C13.2 C14.2 DS6.2(K) J4.6 R16.1 R23.1 U5.4(GND) Y1.2(GND)
VDDA: R22.2
BOOT0: J4.5 ; port BOOT0
ERROR_LED: R21.2 ; port ERROR_LED
HSE_Clock: R15.2 ; port HSE_Clock
LM75_OS: R20.1 U5.3(O.S.) ; port LM75_OS
NRST: J4.2 ; port NRST
SCL: R18.1 U5.2(SCL) ; port LM75_SCL
SDA: R19.1 U5.1(SDA) ; port LM75_SDA
SWCLK: J4.1 ; port SWCLK
SWDIO: J4.3 ; port SWDIO
Thermistor: C14.1 R22.1 R23.2 ; port Thermistor
NetDS6_1: DS6.1(A) R21.1
NetR14_1: R14.1 R16.2 Y1.1(~{Tri-State})
NetR15_1: R15.1 Y1.3(Output)
NetR17_1: R17.1 U5.5(A2) U5.6(A1) U5.7(A0)

### Notes on the sheet
- (near R14) DNP
- Oscillator
- ST-LINK
- (near R16) DNP
- Temperature Sensor
- Thermistor

### Library data of the parts
C12 = CMP-2007-04174-2: as C15 on sheet STM32; Packaging: Tape and Reel; Min Operating Temperature: -55°C; Dielectric Material: Ceramic; Height: 1.4mm; Voltage Rating: 100V; Termination: SMD/SMT; Case Code (Imperial): 0805; Case Code (Metric): 2012; Case/Package: 0805; Construction: Flat; Radiation Hardening: No; Series: -; Dielectric: X7R; Package Quantity: 2000; Mount: Surface Mount; Contact Plating: Tin; Voltage: 100V; Lead Free: Lead Free; Depth: 1.25mm; RoHS Compliant: Yes; Number of Pins: 2; Max Operating Temperature: 125°C; Length: 2.01mm; Voltage Rating (DC): 100V; Thickness: 0.055inch; REACH SVHC: No SVHC; Width: 0.049inch; Tolerance: 10%
C13 = CMP-2007-04174-2: as C22 on sheet DC_load; Packaging: Tape and Reel; Min Operating Temperature: -55°C; Dielectric Material: Ceramic; Height: 1.4mm; Voltage Rating: 100V; Termination: SMD/SMT; Case Code (Imperial): 0805; Case Code (Metric): 2012; Case/Package: 0805; Construction: Flat; Radiation Hardening: No; Series: -; Dielectric: X7R; Package Quantity: 2000; Mount: Surface Mount; Capacitance: 100nF; Contact Plating: Tin; Voltage: 100V; Lead Free: Lead Free; Depth: 1.25mm; RoHS Compliant: Yes; Number of Pins: 2; Max Operating Temperature: 125°C; Length: 2.01mm; Voltage Rating (DC): 100V; Thickness: 0.055inch; REACH SVHC: No SVHC; Width: 0.049inch; Tolerance: 10%
C14 = CMP-2007-04174-2: General Purpose Ceramic Capacitor, 0805, 100pF, 10%, X7R, 15%, 100V; Capacitance: 100nF; Packaging: Tape and Reel; Min Operating Temperature: -55°C; Dielectric Material: Ceramic; Height: 1.4mm; Voltage Rating: 100V; Termination: SMD/SMT; Case Code (Imperial): 0805; Case Code (Metric): 2012; Case/Package: 0805; Construction: Flat; Radiation Hardening: No; Series: -; Dielectric: X7R; Package Quantity: 2000; Mount: Surface Mount; Contact Plating: Tin; Voltage: 100V; Lead Free: Lead Free; Depth: 1.25mm; RoHS Compliant: Yes; Number of Pins: 2; Max Operating Temperature: 125°C; Length: 2.01mm; Voltage Rating (DC): 100V; Thickness: 0.055inch; REACH SVHC: No SVHC; Width: 0.049inch; Tolerance: 10%
DS6 = CMP-2000-05062-1: as DS7 on sheet Power_meter; Operating Temperature Max: 85degC; Datasheet Version: Oct-08; MSL: MSL2A-4weeks; Peak Forward Current: 20mA; Package Description: 2-Pin Surface Mount Device, Body 2 x 1.25 mm, Height 0.8 mm; Datasheet URL: https://datasheet.ciiva.com/29280/180495-da-01-en-chip-led-hsmg-c170-gelb-gruen-29280971.pdf; Storage Temperature Min: -40degC; LED Colour: Green; Wavelength Typ: 570nm; Mounting Type: SMD; Forward Current If Max: 20mA; Dominant Wavelength Typ: 572nm; LED Mounting: SMD; Operating Temperature Range: -30degCto+85degC; Operating Temperature Min: -30degC; Manufacturer URL: http://www.avagotech.com/; Packaging: CutTape; Luminous Intensity Typ: 15mcd; Package Reference: HSMX-C170; Storage Temperature Max: 85degC; Opto Case Style: SMD; Forward Voltage: 2.2V
J4 = CMP-2000-06636-2: CONN HEADER VERT 6POS 2.54MM; Manufacturer: Harwin; Current Rating: 3A; Number Of Contacts: 6; Conn Gender: Male; Conn Orientation: Vertical; Device Class L1: Connectors; ComponentLink2Description: Datasheet; Height: 8.99mm; Temperature Range High: +105°C; Contact Material: Tin,Nickel; RoHS: TRUE; Temperature Range Low: -40°C; ComponentLink2URL: https://cdn.harwin.com/pdfs/M20-998.pdf; Digikey Description: CONN HEADER VERT 6POS 2.54MM; Pitch: 2.54mm; Package: M20-9980346; Device Class L2: Headers and Wire Housings; Manufacturer Part Number: M20-9980346; Number Of Rows: 2; Category: Conn; Lead Free: Yes; Mouser Description: 2.54mm (0.1") Pitch DIL Vertical PC Tail Pin Header, 6.1mm mating pin height, tin, 3+3 contacts; Temperature: -40°C to +105°C; Device Class L3: unset; Octopart: https://octopart.com/m20-9980346-harwin-5436545; Automotive: No
R14-R22 = CMP-2001-04896-1: as R39 on sheet DC_load
R23 = CMP-02404-000019-1: THERM NTC 10KOHM 3984K RING LUG; Max Power Dissipation: 100mW; Accuracy: 0.5%; Resistance: 10kR; Tolerance: 2%; Radiation Hardening: No; Depth: 4.1mm; Contact Plating: Tin; Length: 8.5mm; RoHS Compliant: Yes; Resistance Tolerance: 2%; Packaging: Bulk; Mount: Free Hanging; Termination: Wire; Package Quantity: 500; Max Operating Temperature: 125°C; Series: Automotive, AEC-Q200, NTCA; Number of Pins: 2; Min Operating Temperature: -55°C
U5 = CMP-0066-00336-3: Digital Temperature Sensor and Thermal Watchdog with Two-Wire Interface, 8-pin Mini SOIC, Pb-Free; Manufacturer: Texas Instruments; CompType: Temp Sensor IC; PackageTopMarking: ZXTT*T01B; PowerWise: N; RoHS: Y; ComponentLink1URL: http://www.ti.com/general/docs/lit/getliterature.tsp?genericPartNumber=LM75B&fileType=pdf; PackageDescription: MINI SOIC, .118 x .118 x .034in, 8 Lead, .0256in Pitch; Code_JEDEC: MO-187-AA; PinCount: 8; ComponentLink1Description: Datasheet URL; PackageReference: DGK0008A
Y1 = CMP-27762-013261-1: XTAL Oscillator 8MHz ±30ppm HCMOS, TTL 3.3V 4-SMD 5mm x 3.2mm; Min Supply Voltage: 2.97V; Load Capacitance: 15pF; Max Supply Voltage: 3.63V; Max Supply Current: 15mA; Radiation Hardening: No; Termination: SMD/SMT; Max Operating Temperature: 70°C; Frequency Stability: 30ppm; Series: ASFL1; Package Quantity: 1000; Mount: Surface Mount; Packaging: Tape and Reel; Length: 5mm; Case/Package: SMD/SMT; Lead Free: Lead Free; Operating Supply Voltage: 3.3V; Height: 0.051inch; Frequency: 8MHz; Number of Pins: 4; Depth: 3.2mm; Operating Frequency: 8 MHz; Width: 0.126inch; Min Operating Temperature: -20°C

## Nets that join several sheets
+3.3: DC_load (D?.2), Power_meter (C21.2 R27.2 R28.2 U7.5), RS485 (C1.1 D1.2 R1.2 U1.8), Power_supply (C11.2 R7.2 U4.2 U4.4), STM32 (5 pins), STM32_Peripherals (10 pins)
+24: DC_load (C22.1 U8.5), Power_meter (Q3.3 R34.2), Fan_driver (Q1.3 R9.2), Power_supply (6 pins)
GND: DC_load (7 pins), Power_meter (13 pins), RS485 (5 pins), Fan_driver (5 pins), Power_supply (18 pins), STM32 (7 pins), STM32_Peripherals (9 pins)
VDDA: Power_supply (C9.2 R8.2 U3.6), STM32 (C15.1 C16.1 U6.5), STM32_Peripherals (R22.2)
BOOT0: STM32 (U6.31), STM32_Peripherals (J4.5)
Current_sense: DC_load (C25.1 D?.1 R42.1), STM32 (U6.12)
Current_set: DC_load (R39.2), STM32 (U6.10)
Dir1: RS485 (U1.2 U1.3), STM32 (U6.18)
ERROR_LED: STM32 (U6.14), STM32_Peripherals (R21.2)
FAN1: Fan_driver (R12.1), STM32 (U6.15)
GND_Sensing: Power_meter (R31.1), STM32 (U6.7)
HSE_Clock: STM32 (U6.2), STM32_Peripherals (R15.2)
Input_voltage: DC_load (Q5.2), Power_meter (R24.2 R26.2)
LM75_OS: STM32 (U6.27), STM32_Peripherals (R20.1 U5.3)
NRST: STM32 (U6.4), STM32_Peripherals (J4.2)
Output_ON: Power_meter (R37.1), STM32 (U6.9)
Rx1: RS485 (U1.1), STM32 (U6.20)
SCL: Power_meter (R27.1 U7.4), STM32 (U6.25), STM32_Peripherals (R18.1 U5.2)
SDA: Power_meter (R28.1 U7.3), STM32 (U6.30), STM32_Peripherals (R19.1 U5.1)
SWCLK: STM32 (U6.24), STM32_Peripherals (J4.1)
SWDIO: STM32 (U6.23), STM32_Peripherals (J4.3)
Thermistor: STM32 (U6.11), STM32_Peripherals (C14.1 R22.1 R23.2)
Tx1: RS485 (U1.4), STM32 (U6.19)
Vout_Sensing: Power_meter (R32.2 R33.1), STM32 (U6.6)